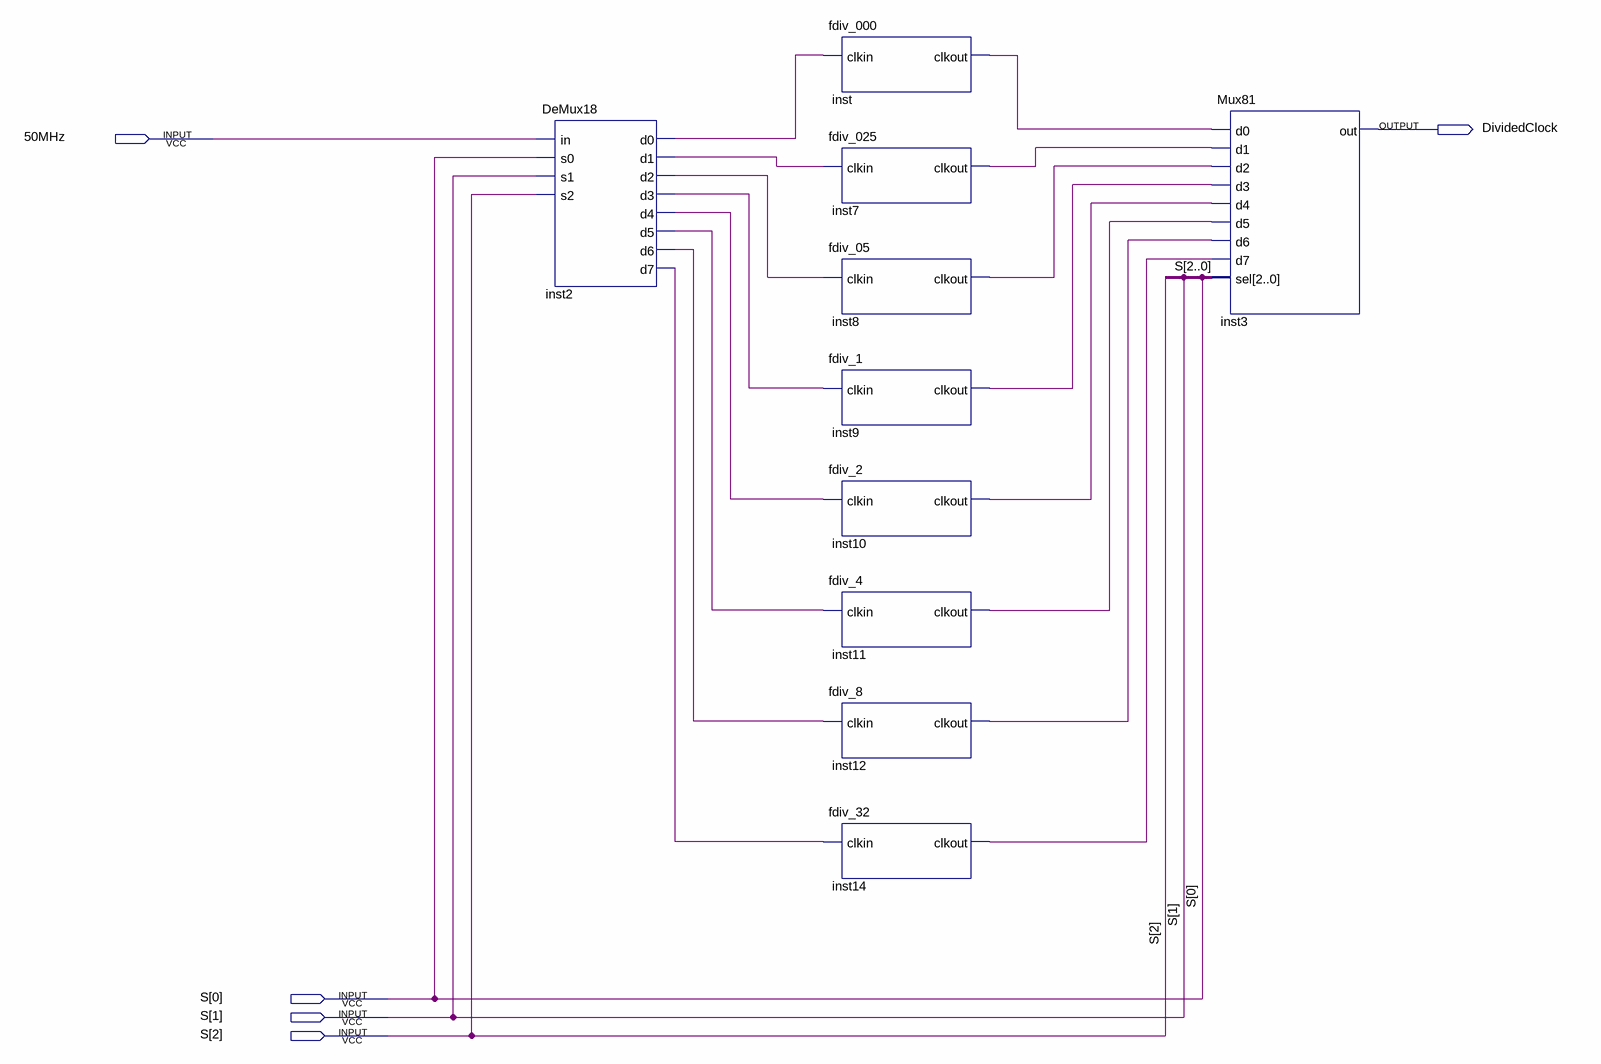
[diagram p0: schematic sheet]
// Quartus schematic VelsDivider.bdf as structural Verilog: 10 symbols, 5 pins
module VelsDivider (
  input  \50MHz ,
  input  [2:0] S,
  output DividedClock
);

  wire inst2_d0, inst2_d1, inst2_d2, inst2_d3, inst2_d4, inst2_d5, inst2_d6, inst2_d7, inst7_clkout,
       inst8_clkout, inst9_clkout, inst10_clkout, inst11_clkout, inst12_clkout, inst14_clkout, inst_clkout;

  DeMux18 inst2 (
    .in(\50MHz ), .s0(S[0]), .s1(S[1]), .s2(S[2]), .d0(inst2_d0), .d1(inst2_d1), .d2(inst2_d2),
    .d3(inst2_d3), .d4(inst2_d4), .d5(inst2_d5), .d6(inst2_d6), .d7(inst2_d7));
  fdiv_000 inst (.clkin(inst2_d0), .clkout(inst_clkout));
  fdiv_025 inst7 (.clkin(inst2_d1), .clkout(inst7_clkout));
  fdiv_05 inst8 (.clkin(inst2_d2), .clkout(inst8_clkout));
  fdiv_1 inst9 (.clkin(inst2_d3), .clkout(inst9_clkout));
  fdiv_2 inst10 (.clkin(inst2_d4), .clkout(inst10_clkout));
  fdiv_4 inst11 (.clkin(inst2_d5), .clkout(inst11_clkout));
  fdiv_8 inst12 (.clkin(inst2_d6), .clkout(inst12_clkout));
  fdiv_32 inst14 (.clkin(inst2_d7), .clkout(inst14_clkout));
  Mux81 inst3 (
    .d0(inst_clkout), .d1(inst7_clkout), .d2(inst8_clkout), .d3(inst9_clkout), .d4(inst10_clkout),
    .d5(inst11_clkout), .d6(inst12_clkout), .d7(inst14_clkout), .sel(S), .out(DividedClock));
endmodule
